# EAGLE design wearable (EAGLE 9.6.2)

## Sheet 1 of 3
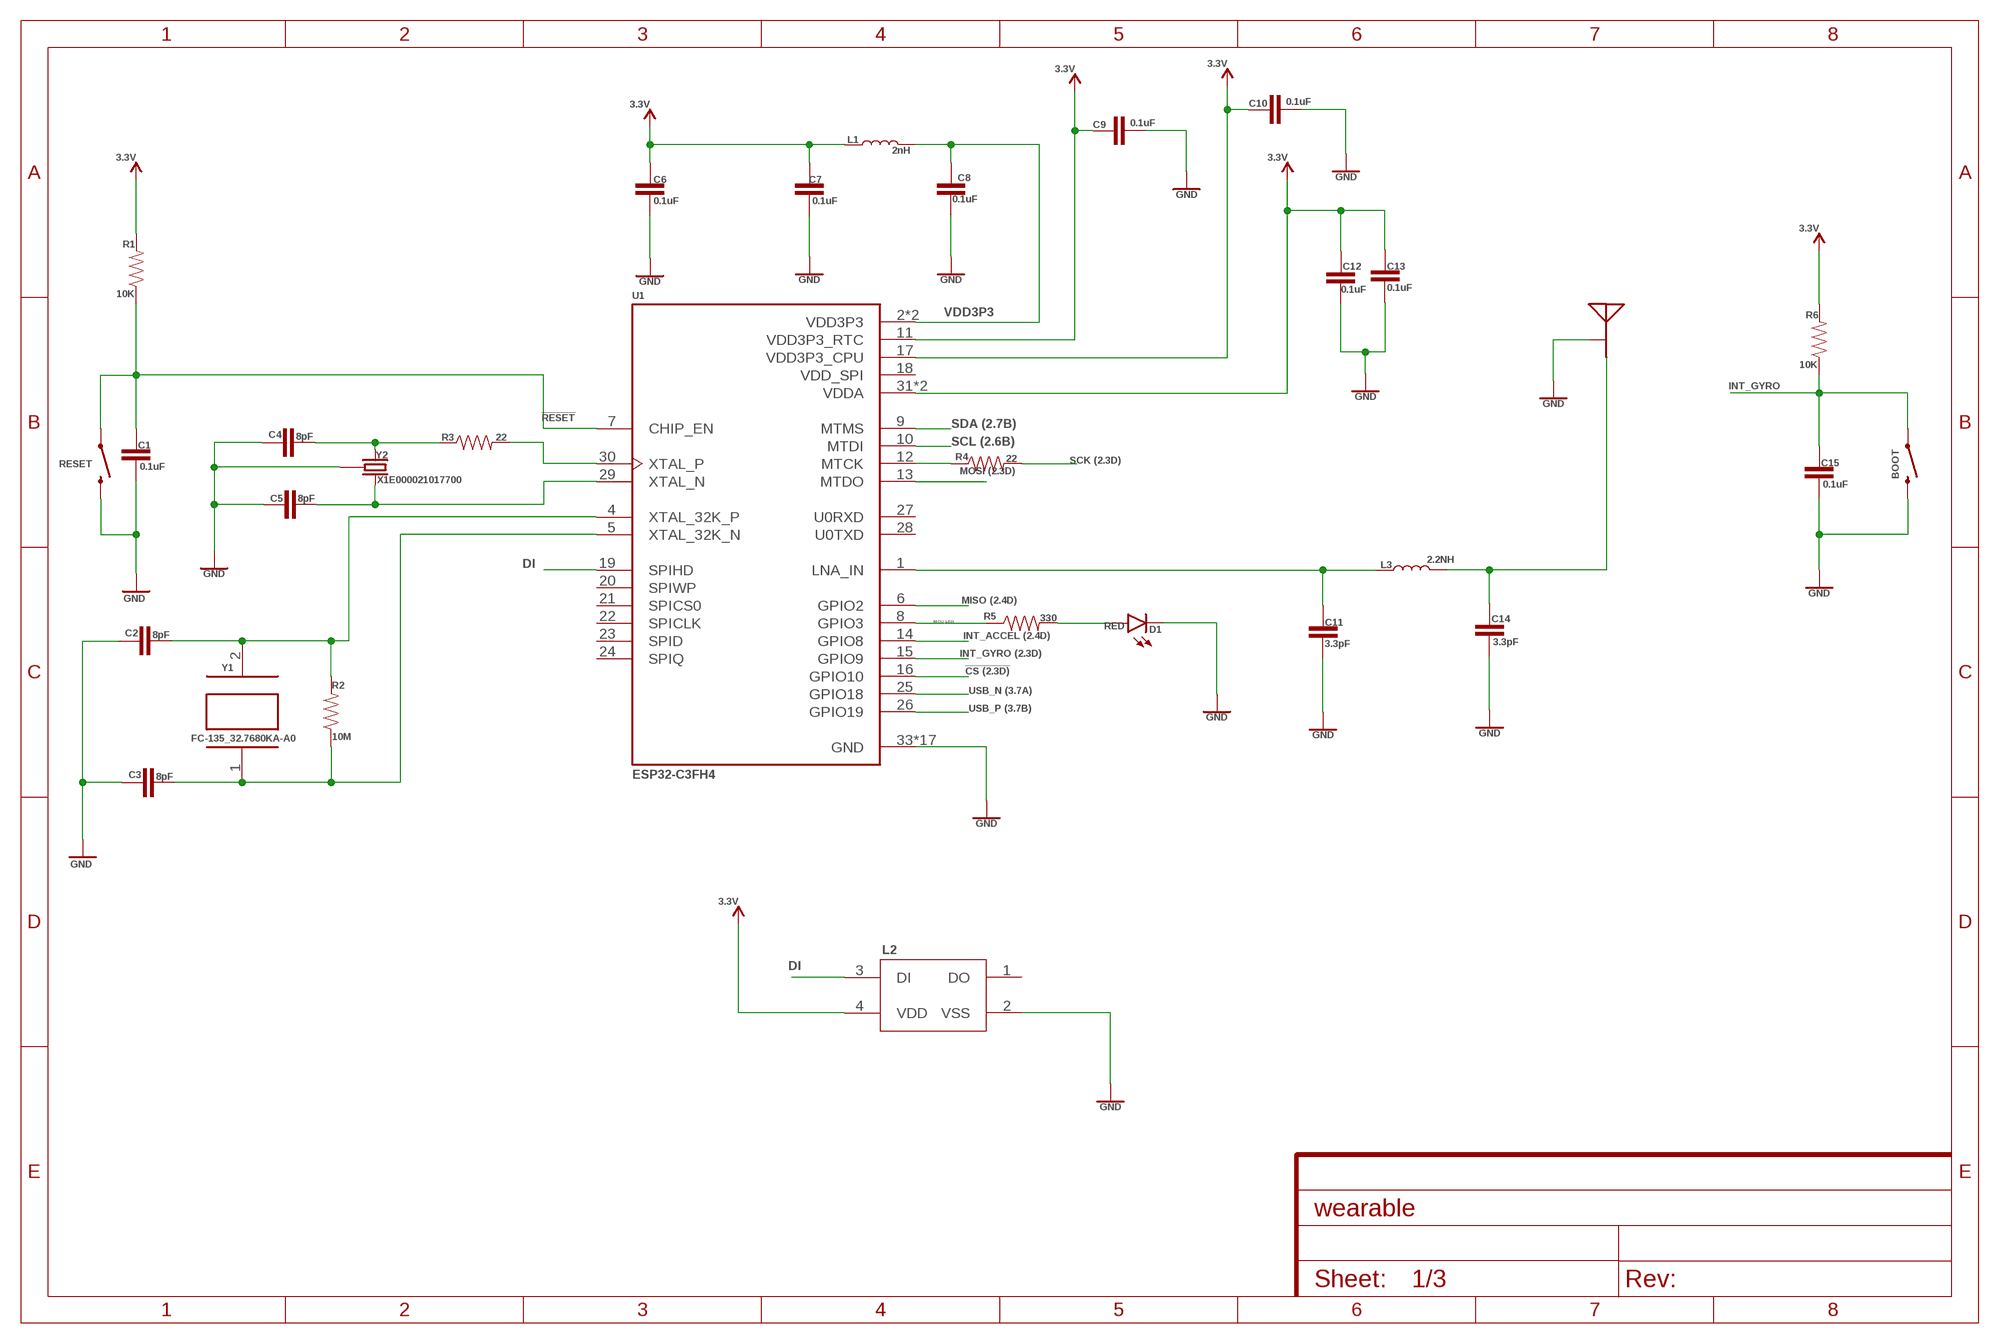
[diagram p0: schematic, sheet 1]

### Parts
ANT1  MEANDER-ANT  [MEANDER-ANT]
BOOT  MOMENTARY-SWITCH-SPST-SMD-4.6X2.8MM  [TACTILE_SWITCH_SMD_4.6X2.8MM]
C1  0.1uF  0.1UF-0402-16V-10%  [0402]
C2  8pF  6PF-0402-50V-0.5%  [0402]
C3  8pF  6PF-0402-50V-0.5%  [0402]
C4  8pF  6PF-0402-50V-0.5%  [0402]
C5  8pF  6PF-0402-50V-0.5%  [0402]
C6  0.1uF  0.1UF-0402-16V-10%  [0402]
C7  0.1uF  0.1UF-0402-16V-10%  [0402]
C8  0.1uF  0.1UF-0402-16V-10%  [0402]
C9  0.1uF  0.1UF-0402-16V-10%  [0402]
C10  0.1uF  0.1UF-0402-16V-10%  [0402]
C11  3.3pF  0.1UF-0402-16V-10%  [0402]
C12  0.1uF  0.1UF-0402-16V-10%  [0402]
C13  0.1uF  0.1UF-0402-16V-10%  [0402]
C14  3.3pF  0.1UF-0402-16V-10%  [0402]
C15  0.1uF  0.1UF-0402-16V-10%  [0402]
D1  RED  LED0603  [LED-0603]
L1  2nH  INDUCTOR-0402-3.9NH  [0402]
L2  WS2812B-2020  [WS2812B-2020]
L3  2.2NH  INDUCTOR-0402-3.9NH  [0402]
R1  10K  RESISTOR0402  [0402]
R2  10M  RESISTOR0402  [0402]
R3  22  22OHM-0402-1/10W-1%  [0402]
R4  22  22OHM-0402-1/10W-1%  [0402]
R5  330  RESISTOR0402  [0402]
R6  10K  RESISTOR0402  [0402]
RESET  MOMENTARY-SWITCH-SPST-SMD-4.6X2.8MM  [TACTILE_SWITCH_SMD_4.6X2.8MM]
U1  ESP32-C3FH4  [QFN50P500X500X90-33N]
Y1  FC-135_32.7680KA-A0  [XTAL_FC-135_32.7680KA-A0]
Y2  X1E000021017700  CRYSTAL-26MHZSMD-3.2X2.5  [CRYSTAL-SMD-3.2X2.5MM]

### Nets
3.3V: C6.1 C7.2 C9.2 C10.2 C12.1 C13.1 L1.1 L2.4(VDD) R1.2 R6.2 U1.11(VDD3P3_RTC) U1.17(VDD3P3_CPU) U1.31(VDDA) U1.32(VDDA) ; also sheet 2,3
!CS: U1.16(GPIO10) ; also sheet 2
!RESET: C1.1 R1.1 RESET.1 RESET.2 U1.7(CHIP_EN)
DI: L2.3(DI) U1.19(SPIHD)
GND: ANT1.GND BOOT.3 BOOT.4 C1.2 C2.1 C3.1 C4.1 C5.1 C6.2 C7.1 C8.1 C9.1 C10.1 C11.2 C12.2 C13.2 C14.2 C15.2 D1.C L2.2(VSS) RESET.3 RESET.4 U1.33(GND) U1.34(GND) U1.35(GND) U1.36(GND) U1.37(GND) U1.38(GND) U1.39(GND) U1.40(GND) U1.41(GND) U1.42(GND) U1.43(GND) U1.44(GND) U1.45(GND) U1.46(GND) U1.47(GND) U1.48(GND) U1.49(GND) Y2.2 Y2.4 ; also sheet 2,3
INT_ACCEL: U1.14(GPIO8) ; also sheet 2
INT_GYRO: BOOT.1 BOOT.2 C15.1 R6.1 U1.15(GPIO9) ; also sheet 2
MCU_LED: R5.1 U1.8(GPIO3)
MISO: U1.6(GPIO2) ; also sheet 2
MOSI: U1.13(MTDO) ; also sheet 2
N$3: R3.2 U1.30(XTAL_P)
N$4: C4.2 R3.1 Y2.1
N$5: C5.2 U1.29(XTAL_N) Y2.3
N$7: C11.1 L3.1 U1.1(LNA_IN)
N$8: ANT1.FEED C14.1 L3.2
N$9: D1.A R5.2
N$12: C2.2 R2.2 U1.4(XTAL_32K_P) Y1.2
N$13: C3.2 R2.1 U1.5(XTAL_32K_N) Y1.1
N$15: R4.1 U1.12(MTCK)
SCK: R4.2 ; also sheet 2
SCL: U1.10(MTDI) ; also sheet 2
SDA: U1.9(MTMS) ; also sheet 2
USB_N: U1.25(GPIO18) ; also sheet 3
USB_P: U1.26(GPIO19) ; also sheet 3
VDD3P3: C8.2 L1.2 U1.2(VDD3P3) U1.3(VDD3P3)
Unconnected: L2.1(DO) U1.20(SPIWP) U1.21(SPICS0) U1.22(SPICLK) U1.23(SPID) U1.24(SPIQ) U1.27(U0RXD) U1.28(U0TXD)

## Sheet 2 of 3
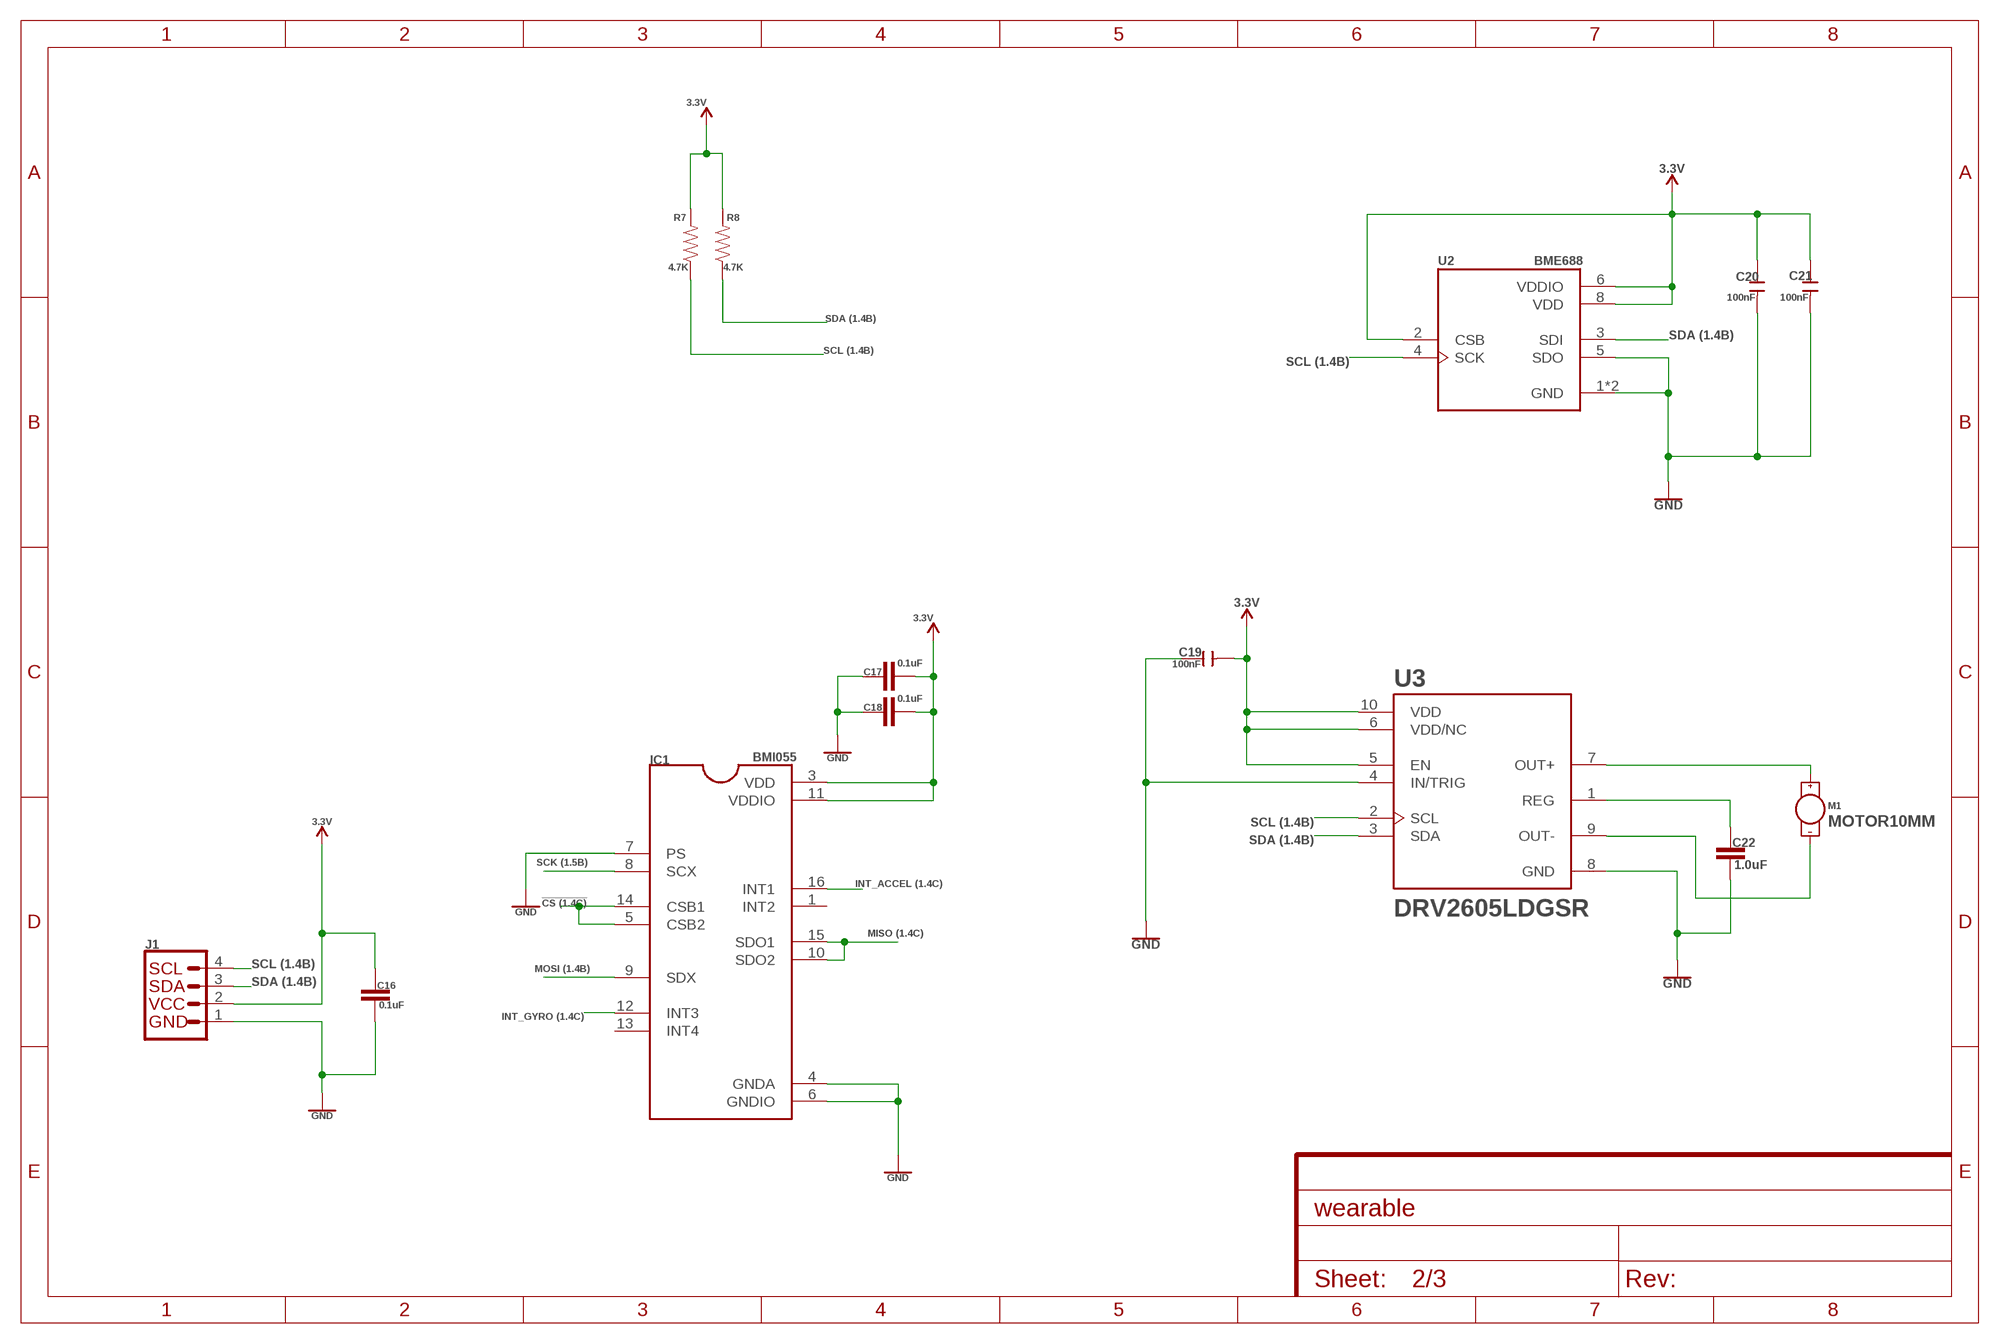
[diagram p1: schematic, sheet 2]

### Parts
C16  0.1uF  0.1UF-0402-16V-10%  [0402]
C17  0.1uF  0.1UF-0402-16V-10%  [0402]
C18  0.1uF  0.1UF-0402-16V-10%  [0402]
C19  100nF  CERAMIC-100NF-25V-10%-X7R(0402)  [C0402]
C20  100nF  CERAMIC-100NF-25V-10%-X7R(0402)  [C0402]
C21  100nF  CERAMIC-100NF-25V-10%-X7R(0402)  [C0402]
C22  1.0uF  1.0UF-0402-16V-10%  [0402]
IC1  BMI055  [QFN50P300X450X100-16N]
J1  QWIIC_CONNECTORJS-1MM  [1X04_1MM_RA]
M1  MOTOR10MM  [VIBE-MOTOR-10MM]
R7  4.7K  RESISTOR0402  [0402]
R8  4.7K  RESISTOR0402  [0402]
U2  BME688  [IC_BME688]
U3  DRV2605LDGSR  [SOP50P490X110-10N]

### Nets
3.3V: C16.1 C17.2 C18.2 C19.2 C20.1 C21.1 IC1.3(VDD) IC1.11(VDDIO) J1.2 R7.2 R8.2 U2.2(CSB) U2.6(VDDIO) U2.8(VDD) U3.5(EN) U3.6(VDD/NC) U3.10(VDD) ; also sheet 1,3
!CS: IC1.5(CSB2) IC1.14(CSB1) ; also sheet 1
GND: C16.2 C17.1 C18.1 C19.1 C20.2 C21.2 C22.2 IC1.4(GNDA) IC1.6(GNDIO) IC1.7(PS) J1.1 U2.1(GND) U2.5(SDO) U2.7(GND) U3.4(IN/TRIG) U3.8(GND) ; also sheet 1,3
INT_ACCEL: IC1.16(INT1) ; also sheet 1
INT_GYRO: IC1.12(INT3) ; also sheet 1
MISO: IC1.10(SDO2) IC1.15(SDO1) ; also sheet 1
MOSI: IC1.9(SDX) ; also sheet 1
N$6: C22.1 U3.1(REG)
N$10: M1.+ U3.7(OUT+)
N$11: M1.- U3.9(OUT-)
SCK: IC1.8(SCX) ; also sheet 1
SCL: J1.4 R7.1 U2.4(SCK) U3.2(SCL) ; also sheet 1
SDA: J1.3 R8.1 U2.3(SDI) U3.3(SDA) ; also sheet 1
Unconnected: IC1.1(INT2) IC1.13(INT4)

## Sheet 3 of 3
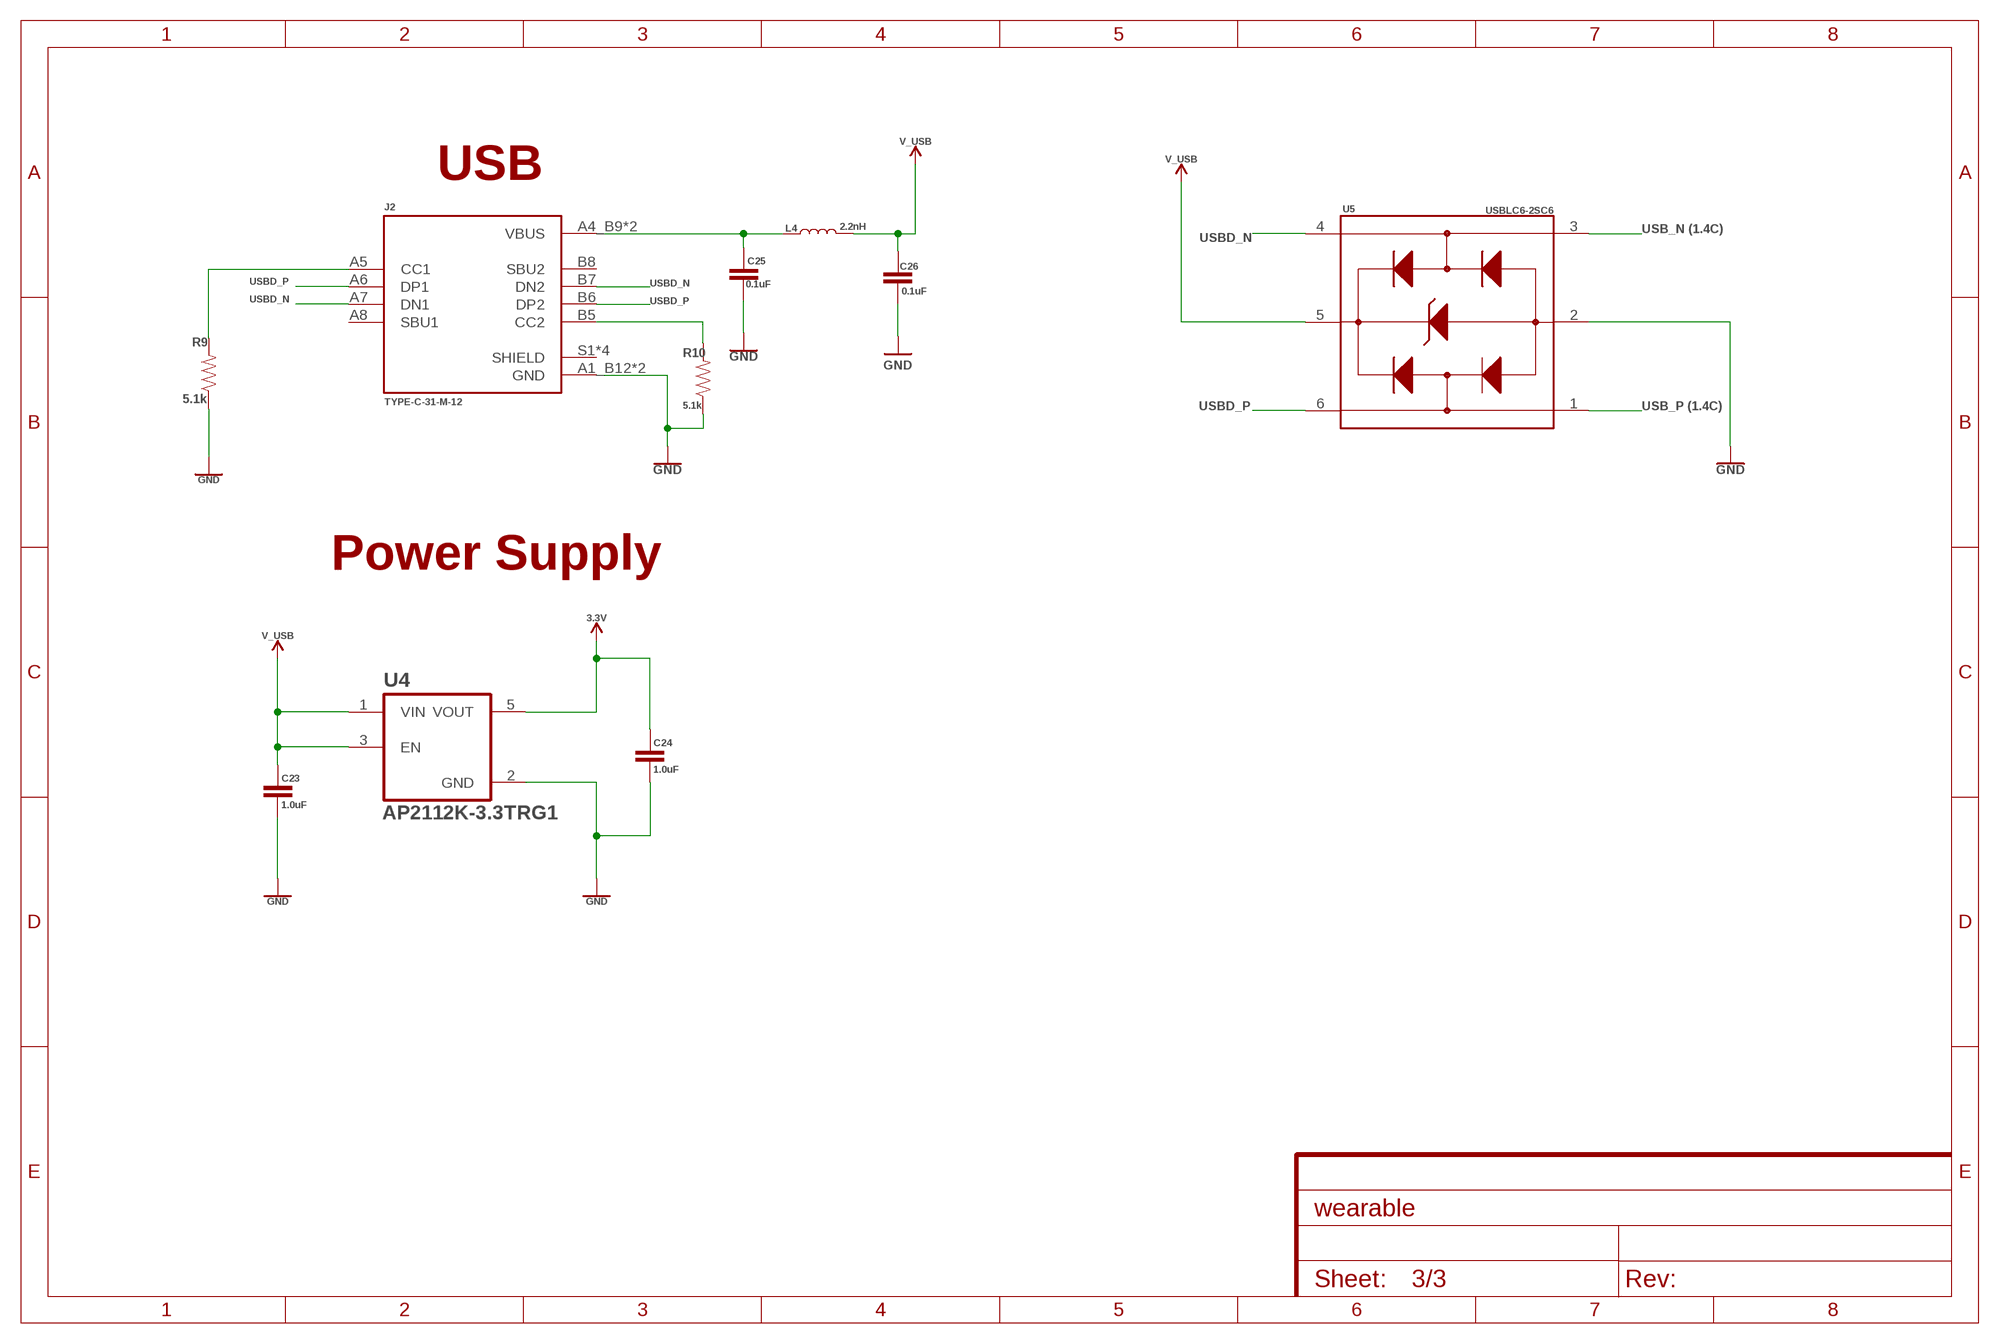
[diagram p2: schematic, sheet 3]

### Parts
C23  1.0uF  1.0UF-0402-16V-10%  [0402]
C24  1.0uF  1.0UF-0402-16V-10%  [0402]
C25  0.1uF  0.1UF-0402-16V-10%  [0402]
C26  0.1uF  0.1UF-0402-16V-10%  [0402]
J2  TYPE-C-31-M-12  [HRO_TYPE-C-31-M-12]
L4  2.2nH  INDUCTOR-0402-3.9NH  [0402]
R9  5.1k  5.6KOHM-0603-1/10W-1%  [0603]
R10  5.1k  5.6KOHM-0603-1/10W-1%  [0603]
U4  AP2112K-3.3TRG1  [SOT95P285X140-5N]
U5  USBLC6-2SC6  [SOT95P280X145-6N]

### Nets
3.3V: C24.1 U4.5(VOUT) ; also sheet 1,2
GND: C23.2 C24.2 C25.2 C26.2 J2.A1_B12(GND) J2.B1_A12(GND) R9.1 R10.1 U4.2(GND) U5.2(GND) ; also sheet 1,2
N$1: J2.A5(CC1) R9.2
N$2: J2.B5(CC2) R10.2
N$14: C25.1 J2.A4_B9(VBUS) J2.B4_A9(VBUS) L4.1
USB_N: U5.3(I/O2_IN) ; also sheet 1
USB_P: U5.1(I/O1_IN) ; also sheet 1
USBD_N: J2.A7(DN1) J2.B7(DN2) U5.4(I/O2_OUT)
USBD_P: J2.A6(DP1) J2.B6(DP2) U5.6(I/O1_OUT)
V_USB: C23.1 C26.1 L4.2 U4.1(VIN) U4.3(EN) U5.5(VBUS)
Unconnected: J2.A8(SBU1) J2.B8(SBU2) J2.S1(SHIELD) J2.S2(SHIELD) J2.S3(SHIELD) J2.S4(SHIELD)

### Notes on the sheet
- USB
- Power Supply

## Power pins joined to a net without a drawn wire
VDD_SPI: U1.18(VDD_SPI)

## Library data of the parts
ANT1 = Antennas:MEANDER-ANT
BOOT RESET = SparkFun-Switches:MOMENTARY-SWITCH-SPST: Momentary Switch (Pushbutton) - SPST Normally-open (NO) SPST momentary switches (buttons, pushbuttons). Variants PTH-12MM - 12mm square, through-hole Momentary Pushbutton Switch - 12mm Square <https://www.sparkfun.com/products/9190> (COM-09190) PTH-6.0MM, PTH-6.0MM-KIT - 6.0mm square, through-hole Mini Pushbutton Switch <https://www.sparkfun.com/products/97> (COM-00097) KIT package intended for soldering kit's - only one side of pads' copper is exposed. PTH-RIGHT-ANGLE-KIT - Right-angle, through-hole Right Angle Tactile Button <https://www.sparkfun.com/products/10791> - Used on SparkFun BigTime Watch Kit <https://www.sparkfun.com/products/11734> SMD-12MM - 12mm square, surface-mount Tactile Button - SMD (12mm) <https://www.sparkfun.com/products/12993> (COM-12993) Used on SparkFun PicoBoard <https://www.sparkfun.com/products/11888> SMD-4.5MM - 4.5mm Square Trackball Switch Used on SparkFun Blackberry Trackballer Breakout <https://www.sparkfun.com/products/13169> SMD-4.6MMX2.8MM - 4.60mm x 2.80mm, surface mount Used on SparkFun SAMD21 Mini Breakout <https://www.sparkfun.com/products/13664> SMD-5.2MM, SMD-5.2-REDUNDANT - 5.2mm square, surface-mount Mini Pushbutton Switch - SMD <https://www.sparkfun.com/products/8720> (COM-08720) Used on Arduino Pro Mini <https://www.sparkfun.com/products/11114> REDUNDANT package connects both switch circuits together SMD-6.0X3.5MM - 6.0 x 3.5mm, surface mount Momentary Reset Switch SMD <https://www.sparkfun.com/products/8229> (COM-08229) SMD-6.2MM-TALL - 6.2mm square, surface mount Tactile Button - SMD (6mm) <https://www.sparkfun.com/products/12992> Used on SparkFun Digital Sandbox <https://www.sparkfun.com/products/12651> SMD-RIGHT-ANGLE - Right-angle, surface mount Used on SparkFun Block for Intel® Edison - Arduino <https://www.sparkfun.com/products/13036>; PROD_ID: SWCH-13065
C1 C6-C10 C12 C13 C15-C18 C25 C26 = SparkFun-Capacitors:0.1UF: 0.1µF ceramic capacitors A capacitor is a passive two-terminal electrical component used to store electrical energy temporarily in an electric field.; PROD_ID: CAP-12416
C2-C5 = SparkFun-Capacitors:6PF: 6pF ceramic capacitors A capacitor is a passive two-terminal electrical component used to store electrical energy temporarily in an electric field.; PROD_ID: CAP-13455; VALUE: 6pF
C11 C14 = SparkFun-Capacitors:0.1UF: 0.1µF ceramic capacitors A capacitor is a passive two-terminal electrical component used to store electrical energy temporarily in an electric field.; PROD_ID: CAP-12416; VALUE: 0.1uF
C19-C21 = OPL_Capacitor:CERAMIC-100NF-25V-10%-X7R(0402): 302010024; MPN: CC0402KRX7R8BB104; VALUE: 100nf
C22-C24 = SparkFun-Capacitors:1.0UF: 1µF ceramic capacitors A capacitor is a passive two-terminal electrical component used to store electrical energy temporarily in an electric field.; PROD_ID: CAP-12417
D1 = SparkFun-LED:LED: LED (Generic) Standard schematic elements and footprints for 5mm, 3mm, 1206, and 0603 sized LEDs. Generic LEDs with no color specified.
IC1 = BMI055:BMI055: BMI055 6 Axis Inertial Sensor (12 Bit Acceleration Sensor + Gyroscope) 3 x 4 mm Check availability <https://pricing.snapeda.com/parts/BMI055/Bosch/view-part?ref=eda>; AVAILABILITY: In Stock; DESCRIPTION: BMI055 series Accelerometer, Gyroscope, 6 Axis Sensor Evaluation Board; MF: Bosch; MP: BMI055; PACKAGE: LGA-16 Bosch; PRICE: None; PURCHASE-URL: https://pricing.snapeda.com/search/part/BMI055/?ref=eda
J1 = SparkFun-Connectors:QWIIC_CONNECTOR: SparkFun I2C Standard Qwiic Connector An SMD 1mm pitch JST connector makes it easy and quick (get it? Qwiic?) to connect I2C devices to each other. The Qwiic system <http://www.sparkfun.com/qwiic> enables fast and solderless connection between popular platforms and various sensors and actuators. We carry 200mm <https://www.sparkfun.com/products/14204>, 100mm <https://www.sparkfun.com/products/14205>, 50mm <https://www.sparkfun.com/products/14206>, and breadboard friendly <https://www.sparkfun.com/products/14207> Qwiic cables. We also offer 10 pcs strips <https://www.sparkfun.com/products/14323> the SMD connectors.; PROD_ID: CONN-13694
J2 = TYPE-C-31-M-12:TYPE-C-31-M-12: Check availability <https://pricing.snapeda.com/parts/TYPE-C-31-M-12/HRO%20Electronics%20Co.%2C%20Ltd./view-part?ref=eda>; AVAILABILITY: Not in stock; DESCRIPTION: USB Connectors 24 Receptacle 1 8.94*7.3mm RoHS; MF: HRO Electronics Co., Ltd.; MP: TYPE-C-31-M-12; PACKAGE: Package; PRICE: None
L1 L3 L4 = SparkFun-Coils:INDUCTOR: Inductors Resist changes in electrical current. Basically a coil of wire. SparkFun Products: SparkFun Load Cell Amplifier - HX711 <https://www.sparkfun.com/products/13879> IOIO-OTG - V2.2 <https://www.sparkfun.com/products/13613>; PROD_ID: NDUC-13457; VALUE: 3.9NH
L2 = WS2812B-2020:WS2812B-2020: A small 2x2mm addressable RGB led Check availability <https://pricing.snapeda.com/parts/WS2812B-2020/WorldSemi/view-part?ref=eda>; AVAILABILITY: Not in stock; DESCRIPTION: Programmable LED; SMD; 2020; RGB; 2x2x0.84mm; 3.7÷5.3V; 2kHz; MF: WorldSemi; MP: WS2812B-2020; PACKAGE: None; PRICE: None
M1 = SparkFun-Electromechanical:MOTOR: Motor (Single-Phase) Two-terminal, single-phase motors. SparkFun Products Vibration Motor <https://www.sparkfun.com/products/8449> (ROB-08449) Physical dimension and wire connections for this powerful vibration motor. Motor has a self adhesive backing.; PROD_ID: COMP-08572; SF_SKU: ROB-08449
R1 R2 R5-R8 = SparkFun-Resistors:RESISTOR: Generic Resistor Package
R3 R4 = SparkFun-Resistors:22OHM: 22Ω resistor A resistor is a passive two-terminal electrical component that implements electrical resistance as a circuit element. Resistors act to reduce current flow, and, at the same time, act to lower voltage levels within circuits. - Wikipedia; PROD_ID: RES-12427
R9 R10 = SparkFun-Resistors:5.6KOHM: 5.6kΩ resistor A resistor is a passive two-terminal electrical component that implements electrical resistance as a circuit element. Resistors act to reduce current flow, and, at the same time, act to lower voltage levels within circuits. - Wikipedia; PROD_ID: RES-12378; VALUE: 5.6k
U1 = ESP32-C3FH4:ESP32-C3FH4: Check availability <https://pricing.snapeda.com/parts/ESP32-C3FH4/Espressif%20Systems/view-part?ref=eda>; AVAILABILITY: In Stock; DESCRIPTION: Bluetooth, WiFi 802.11b/g/n, Bluetooth v5.0 Transceiver Module 2.402GHz ~ 2.48GHz Antenna Not Included Surface Mount; MF: Espressif Systems; MP: ESP32-C3FH4; PACKAGE: VFQFN-32 Espressif Systems; PRICE: None; PURCHASE-URL: https://pricing.snapeda.com/search/part/ESP32-C3FH4/?ref=eda
U2 = BME688:BME688: Gas sensor measuring relative humidity, barometric pressure, ambient temperature and gas (VOC) Check availability <https://pricing.snapeda.com/parts/BME688/Bosch%20Sensortec/view-part?ref=eda>; AVAILABILITY: In Stock; DESCRIPTION: Gas sensor measuring relative humidity, barometric pressure, ambient temperature and gas (VOC); MF: Bosch Sensortec; MP: BME688; PACKAGE: None; PRICE: None; PURCHASE-URL: https://pricing.snapeda.com/search/part/BME688/?ref=eda
U3 = DRV2605LDGSR:DRV2605LDGSR: Haptic Driver for ERM and LRA with Built-In Library and Smart Loop Architecture 10-VSSOP -40 to 85 Check availability <https://pricing.snapeda.com/parts/DRV2605LDGSR/Texas%20Instruments/view-part?ref=eda>; AVAILABILITY: In Stock; DESCRIPTION: Haptic driver for ERM/LRA with 2-V operation, waveform library & auto-resonance tracking; MF: Texas Instruments; MP: DRV2605LDGSR; PACKAGE: VSSOP-10 Texas Instruments; PRICE: None; PURCHASE-URL: https://pricing.snapeda.com/search/part/DRV2605LDGSR/?ref=eda
U4 = AP2112K-3.3TRG1:AP2112K-3.3TRG1: AP2112 Series 0.6 A 3.3 V Fixed Output SMT LDO Linear Regulator - SOT23-5 Check availability <https://pricing.snapeda.com/parts/AP2112K-3.3TRG1/Diodes%20Inc./view-part?ref=eda>; AVAILABILITY: In Stock; DESCRIPTION: Linear Voltage Regulator IC Positive Fixed 1 Output 600mA SOT-25; MF: Diodes Inc.; MP: AP2112K-3.3TRG1; PACKAGE: SOT-753 Diodes Inc.; PRICE: None; PURCHASE-URL: https://pricing.snapeda.com/search/part/AP2112K-3.3TRG1/?ref=eda
U5 = USBLC6-2SC6:USBLC6-2SC6: Check availability <https://pricing.snapeda.com/parts/USBLC6-2SC6/STMicroelectronics/view-part?ref=eda> Check availability <https://pricing.snapeda.com/parts/USBLC6-2SC6/STMicroelectronics/view-part?ref=eda> Check availability <https://pricing.snapeda.com/parts/USBLC6-2SC6/STMicroelectronics/view-part?ref=eda>; AVAILABILITY: In Stock; DESCRIPTION: 17V Clamp 5A (8/20µs) Ipp Tvs Diode Surface Mount SOT-23-6; MF: STMicroelectronics; MP: USBLC6-2SC6; PACKAGE: SOT-23-6 STMicroelectronics; PRICE: None; PURCHASE-URL: https://pricing.snapeda.com/search/part/USBLC6-2SC6/?ref=eda
Y1 = FC-135_32.7680KA-A0:FC-135_32.7680KA-A0: None Check availability <https://pricing.snapeda.com/parts/FC-135%2032.7680KA-A0/EPSON/view-part?ref=eda>; AVAILABILITY: In Stock; DESCRIPTION: 32.768 kHz ±20ppm Crystal 12.5pF 70 kOhms 2-SMD, No Lead; MF: EPSON; MP: FC-135 32.7680KA-A0; PACKAGE: SMD-2 Epson; PRICE: None; PURCHASE-URL: https://pricing.snapeda.com/search/part/FC-135 32.7680KA-A0/?ref=eda
Y2 = SparkFun-Clocks:CRYSTAL-26MHZ: 26MHz Crystal w/ Ground Pin Digikey Example <http://www.digikey.com/product-detail/en/epson/TSX-3225%2026.0000MF09Z-AC3/SER3627CT-ND/1802878> Frequency: 26MHz Frequency Stability: ±9ppm Frequency Tolerance: ±10ppm Load Capacitance: 9pF SparkFun Products: SparkFun ESP32 Thing <https://www.sparkfun.com/products/13907> SparkFun ESP8266 Thing Dev Board <https://www.sparkfun.com/products/13711>; PROD_ID: XTAL-12454

## Board
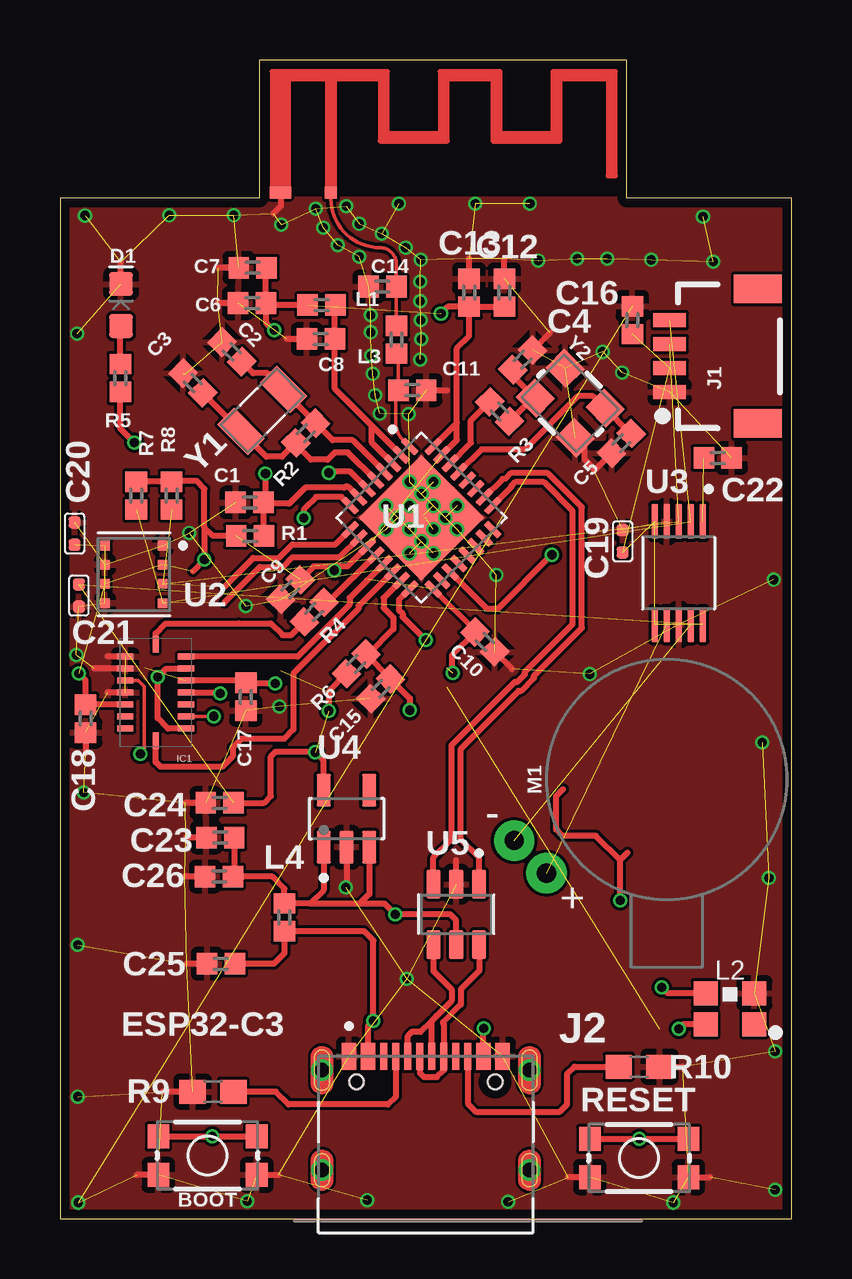
[diagram p3: board, top side]
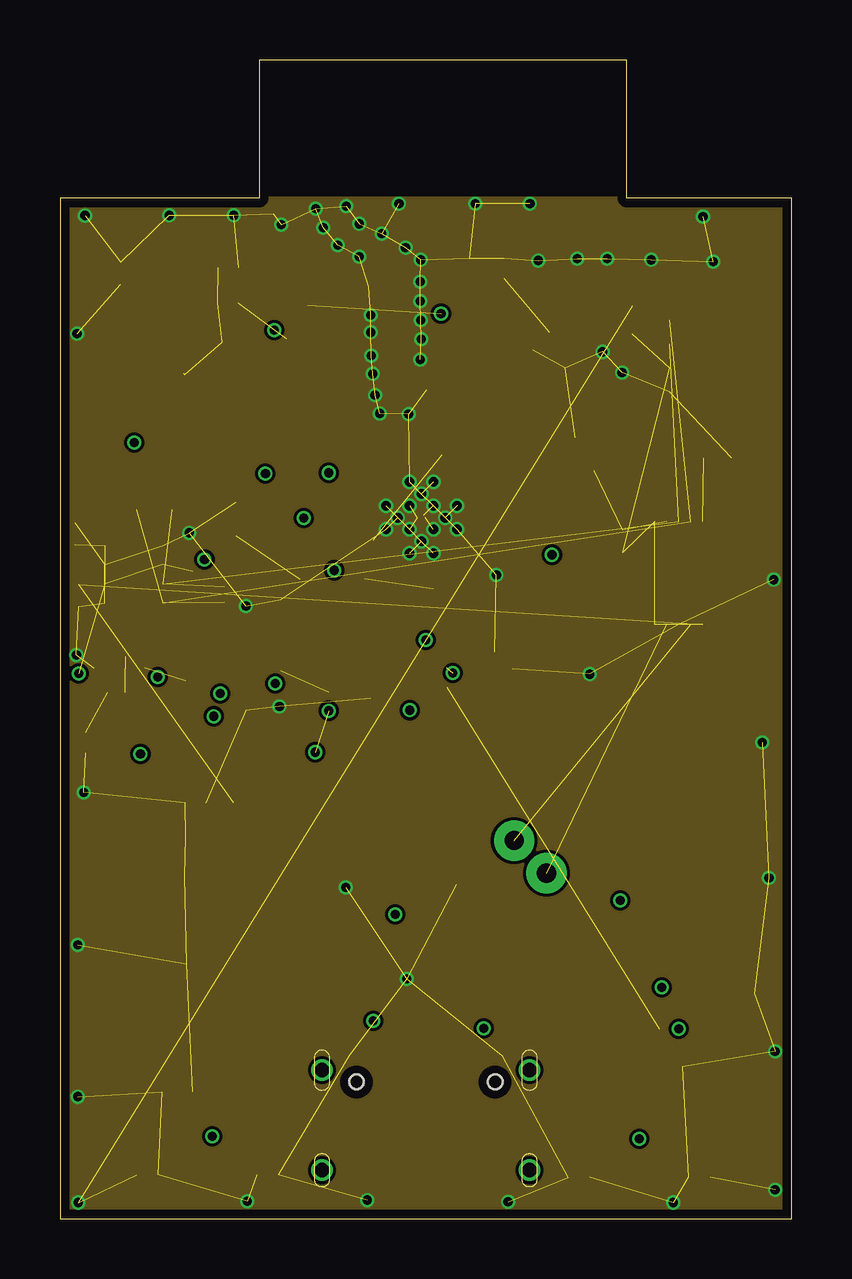
[diagram p4: board, inner layer Route2]
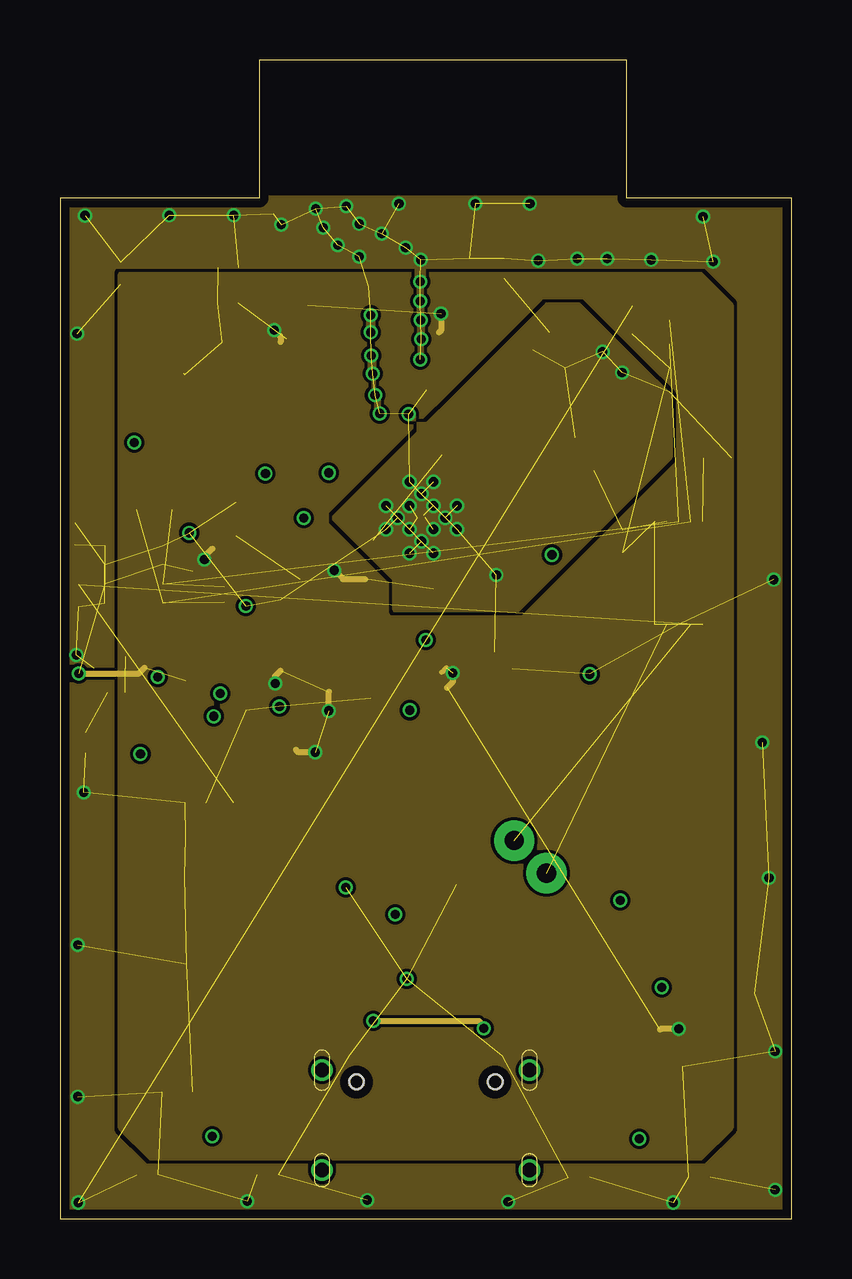
[diagram p5: board, inner layer Route15]
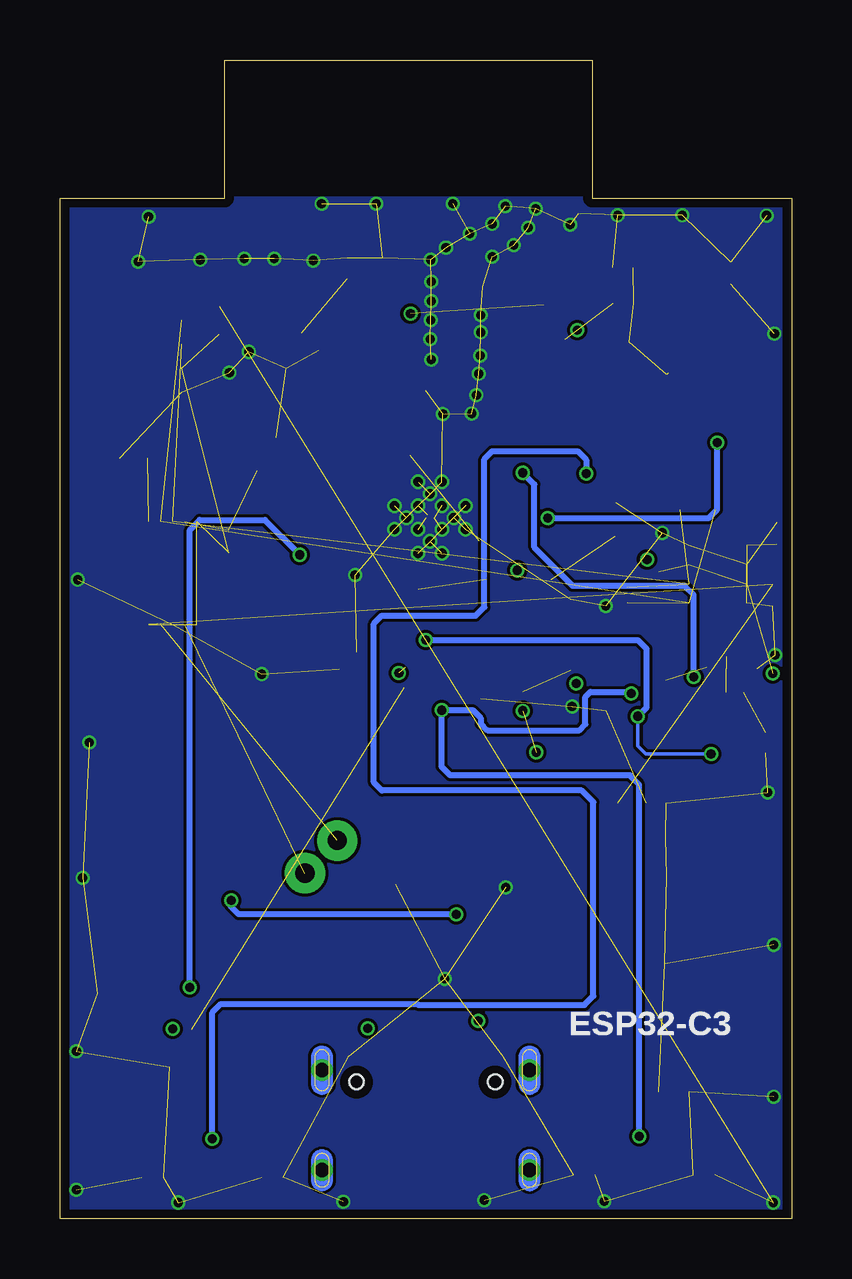
[diagram p6: board, bottom side, seen from below]

Size 30.48 x 48.31 mm. Coordinates in mm from the lower left corner, seen from the top.
Outline: 0,0 30.48,0 30.48,42.54 23.62,42.54 23.62,48.31 8.31,48.31 8.31,42.55 0,42.54 0,0
Copper layers (1*2*15*16): Top 0.035559375mm / dielectric 0.17018125mm / Route2 0.01778125mm / dielectric 47mil / Route15 0.01778125mm / dielectric 0.17018125mm / Bottom 0.035559375mm
Design rules "oshpark-4layer": minimum track width 5mil, minimum drill 10mil, track to track 5mil, track to pad 5mil, pad to pad 5mil, via to via 5mil, smd to smd 5mil, copper to edge 15mil, drill to drill 6mil, minimum pad ring 4mil, minimum via ring 4mil, stop-mask expansion 1.5mil, vias tented up to drill 0mil, thermal gap 10mil

### Footprints (pad centres in the part's own frame; a part is rotated, then mirrored left to right if it is on the bottom)
MEANDER-ANT = smd 0.5 x 0.5: FEED 2.55,-0.25 | smd 0.9 x 0.5: GND 0.45,-0.25
TACTILE_SWITCH_SMD_4.6X2.8MM = smd 0.9 x 1: 1 -2.05,-0.8; 2 2.05,-0.8; 3 2.05,0.8; 4 -2.05,0.8
0402 = smd 0.85 x 0.9: 1 -0.58,0; 2 0.58,0
C0402 = smd 0.5 x 0.5: 1 0,0.463; 2 0,-0.463
LED-0603 = smd 1 x 1: A -0.877,0; C 0.877,0
QFN50P300X450X100-16N = smd 0.675 x 0.25: 1 1.265,1.499; 2 1.265,0.999; 3 1.265,0.499; 4 1.265,-0.001; 5 1.265,-0.501; 6 1.265,-1.001; 7 1.265,-1.501; 9 -1.262,-1.5; 10 -1.262,-1; 11 -1.262,-0.5; 12 -1.262,0; 13 -1.262,0.5; 14 -1.262,1; 15 -1.262,1.5 | smd 0.25 x 0.675: 8 0,-2.012; 16 0,2.013
1X04_1MM_RA = smd 0.6 x 1.35: 1 -1.5,0; 2 -0.5,0; 3 0.5,0; 4 1.5,0 | smd 1.2 x 2: NC1 2.8,-3.675; NC2 -2.8,-3.675
HRO_TYPE-C-31-M-12 = smd 0.6 x 1.14: A1_B12 -3.2,4.75; A4_B9 -2.4,4.75; B1_A12 3.2,4.75; B4_A9 2.4,4.75 | smd 0.3 x 1.14: A5 -1.25,4.75; A6 -0.25,4.75; A7 0.25,4.75; A8 1.25,4.75; B5 1.75,4.75; B6 0.75,4.75; B7 -0.75,4.75; B8 -1.75,4.75 | drill 0.6 pad 0.9: S1 -4.325,4.17; S2 4.325,4.17; S3 -4.325,0; S4 4.325,0 | hole 0.6: -2.89,3.68; 2.89,3.68
WS2812B-2020 = smd 1 x 1: 1 1.015,-0.65; 2 1.015,0.65; 3 -1.015,0.65; 4 -1.015,-0.65
VIBE-MOTOR-10MM = drill 0.8 pad 1.676: + -5,-3.9; - -6.35,-2.54
0603 = smd 1.1 x 1: 1 -0.85,0; 2 0.85,0
QFN50P500X500X90-33N = smd 0.81 x 0.27: 1 -2.45,1.75; 2 -2.45,1.25; 3 -2.45,0.75; 4 -2.45,0.25; 5 -2.45,-0.25; 6 -2.45,-0.75; 7 -2.45,-1.25; 8 -2.45,-1.75; 17 2.45,-1.75; 18 2.45,-1.25; 19 2.45,-0.75; 20 2.45,-0.25; 21 2.45,0.25; 22 2.45,0.75; 23 2.45,1.25; 24 2.45,1.75 | smd 0.27 x 0.81: 9 -1.75,-2.45; 10 -1.25,-2.45; 11 -0.75,-2.45; 12 -0.25,-2.45; 13 0.25,-2.45; 14 0.75,-2.45; 15 1.25,-2.45; 16 1.75,-2.45; 25 1.75,2.45; 26 1.25,2.45; 27 0.75,2.45; 28 0.25,2.45; 29 -0.25,2.45; 30 -0.75,2.45; 31 -1.25,2.45; 32 -1.75,2.45 | smd 3.7 x 3.7: 33 0,0 | drill 0.4 pad 0.5: 34 -0.7,1.4; 35 0.7,1.4; 36 -1.4,0.7; 37 -0.7,0.7; 38 0,0.7; 39 0.7,0.7; 40 1.4,0.7; 41 -0.7,0; 42 0.7,0; 43 -1.4,-0.7; 44 -0.7,-0.7; 45 0,-0.7; 46 0.7,-0.7; 47 1.4,-0.7; 48 -0.7,-1.4; 49 0.7,-1.4
IC_BME688 = smd 0.4 x 0.4: 1 1.2,1.2; 2 1.2,0.4; 3 1.2,-0.4; 4 1.2,-1.2; 5 -1.2,-1.2; 6 -1.2,-0.4; 7 -1.2,0.4; 8 -1.2,1.2
SOP50P490X110-10N = smd 1.47 x 0.28: 1 -2.15,1; 2 -2.15,0.5; 3 -2.15,0; 4 -2.15,-0.5; 5 -2.15,-1; 6 2.15,-1; 7 2.15,-0.5; 8 2.15,0; 9 2.15,0.5; 10 2.15,1
SOT95P285X140-5N = smd 1.35 x 0.6: 1 -1.185,0.95; 2 -1.185,0; 3 -1.185,-0.95; 4 1.185,-0.95; 5 1.185,0.95
SOT95P280X145-6N = smd 1.21 x 0.59: 1 -1.255,0.95; 2 -1.255,0; 3 -1.255,-0.95; 4 1.255,-0.95; 5 1.255,0; 6 1.255,0.95
XTAL_FC-135_32.7680KA-A0 = smd 1 x 1.8: 1 -1.25,0; 2 1.25,0
CRYSTAL-SMD-3.2X2.5MM = smd 1.2 x 1.1: 1 -1.175,-0.875; 2 1.175,-0.875; 3 1.175,0.875; 4 -1.175,0.875

### Placement (x,y rotation side)
ANT1  8.74,43.03 0 top
BOOT  6.15,2.64 180 top
C1  7.9,29.87 180 top
C2  7.16,36.14 315 top
C3  5.54,34.85 315 top
C4  19.28,35.81 225 top
C5  23.39,32.33 45 top
C6  8,38.18 180 top
C7  8.03,39.65 0 top
C8  10.87,36.68 0 top
C9  9.6,26.24 45 top
C10  17.7,24.05 135 top
C11  14.68,34.54 0 top
C12  18.52,38.61 90 top
C13  17.04,38.61 90 top
C14  13.44,38.86 180 top
C15  13.36,22.1 225 top
C16  23.85,37.47 90 top
C17  7.75,21.77 90 top
C18  1.07,20.85 90 top
C19  23.44,28.24 0 top
C20  0.61,28.57 180 top
C21  0.79,25.98 0 top
C22  27.41,31.72 0 top
C23  6.68,15.9 180 top
C24  6.65,17.35 180 top
C25  6.71,10.64 180 top
C26  6.63,14.27 180 top
D1  2.54,38.1 90 top
IC1  3.99,21.95 180 top
J1  25.4,35.97 90 top
J2  15.24,2.03 0 top
L1  10.9,38.1 0 top
L2  27.91,8.76 0 top
L3  14.02,36.65 90 top
L4  9.35,12.57 90 top
M1  25.27,18.31 0 top
R1  7.92,28.47 180 top
R2  10.24,32.77 45 top
R3  18.31,33.66 135 top
R4  10.59,25.3 225 top
R5  2.51,35.05 90 top
R6  12.34,23.14 225 top
R7  3.17,30.15 90 top
R8  4.65,30.15 90 top
R9  6.38,5.31 0 top
R10  24.13,6.35 180 top
RESET  24.13,2.54 180 top
U1  15.06,29.24 315 top
U2  3.07,26.87 0 top
U3  25.78,26.92 270 top
U4  11.94,16.69 90 top
U5  16.51,12.7 270 top
Y1  8.43,33.71 45 top
Y2  21.26,34.01 315 top

### Tracks (layer width: path | path; a pad name or v marks a point on that pad's centre or on a via)
3.3V  (via drill 0.38)  (21 unrouted)
  Top 0.203: U1.17 17.29,24.53 C10.2
  Top 0.254: 13.04,28.28 U1.11 11.97,27.2 11.43,27.2 | U4.5 10.99,19.11 v10.64,19.46 10.62,19.48 8.99,19.48 8.79,19.28 8.79,17.63 8.51,17.35 C24.1 | U1.32 16.54,33.18 | C13.1 17.04,36.8 16.54,36.3 16.54,33.18 | C13.1 C12.1 | U1.31 16.54,32.48 16.54,33.18 | R7.2 R8.2 4.68,30.76 5.69,30.76 6.02,30.43 6.02,28.83 | L1.1 8.66,38.1 C6.1 | C6.1 8.58,39.62 C7.2 | C6.1 8.58,37.37 8.91,37.03 v8.93,37.05 | C9.2 10.57,27.2 11.43,27.2 | 11.43,27.2 v11.43,27.04 | R1.2 6.38,28.47 6.02,28.83 | 5.53,27 v6.02,27.48 6.02,28.83 | IC1.3 1.08,21.45 C18.2 1.07,22.45 v0.79,22.73 | IC1.11 7.65,22.45 C17.2 8.95,22.35 v8.97,22.33 | R6.2 11.2,22 v11.2,21.18 | L2.4 25.97,8.11 v25.78,7.92 | C13.1 16.16,38.03 v15.88,37.74 | C10.2 16.33,23.5 16.33,22.78 v16.36,22.76
  Route15 0.203: 16.1,22.99 15.9,22.78
  Route15 0.254: v10.64,19.46 9.93,19.46 9.83,19.56 | v8.93,37.05 9.2,36.78 9.2,36.55 | v11.43,27.04 11.8,26.67 12.7,26.67 | v6.02,27.48 6.02,27.61 6.35,27.94 | v0.79,22.73 3.28,22.73 3.53,22.99 | v11.2,21.18 11.2,21.97 | v8.97,22.33 8.97,22.63 9.2,22.86 | v25.78,7.92 25.02,7.92 24.99,7.9 | v15.88,37.74 15.88,37.03 15.8,36.96 | v16.36,22.76 16.36,22.38 16.13,22.15
  pour Route15 (rank 2): 2.54,39.37 26.67,39.37 27.94,38.1 27.94,3.81 26.67,2.54 3.81,2.54 2.54,3.81
!CS  (via drill 0.38)
  Top 0.152: v6.4,20.95 IC1.14 | IC1.5 3.26,22.45 3.5,22.2 3.5,19.53 v3.35,19.38
  Top 0.254: U1.16 14.12,25.82 14.12,25.38 14.27,25.23 14.27,25.09 v15.24,24.13
  Bottom 0.152: v6.4,20.95 6.4,19.71 6.07,19.38 v3.35,19.38
  Bottom 0.254: v15.24,24.13 6.4,24.13 6.04,23.77 6.04,21.31 v6.4,20.95
!RESET  (via drill 0.38)
  Top 0.254: RESET.2 v24.13,3.34 RESET.1 | R1.1 8.48,28.5 8.48,29.82 | 8.48,29.82 C1.1 8.56,29.95 v8.56,31.06 | U1.7 12,30.53 11.89,30.53 11.84,30.48 10.21,30.48 9.55,29.82 8.48,29.82
  Bottom 0.254: v24.13,3.34 24.13,8.61 23.77,8.97 15.6,8.97 15.55,8.91 8.64,8.91 8.25,9.3 8.25,17.37 8.74,17.86 17.07,17.86 17.4,18.19 17.4,24.82 17.07,25.15 13.16,25.15 12.8,25.5 12.8,31.67 12.47,32 8.91,32 8.56,31.65 v8.56,31.06
DI  (via drill 0.38)
  Top 0.254: L2.3 25.31,9.41 v25.07,9.65 | v20.5,27.69 18.24,25.43 17.81,25.43 U1.19
  Bottom 0.254: v25.07,9.65 25.07,28.73 24.66,29.13 21.95,29.13 v20.5,27.69
GND  (via drill 0.38)  (123 unrouted)
  Top 0.254: R10.1 25.93,6.35 | R9.1 4.27,5.31 | C13.2 17.04,40.04 | C23.2 5.25,15.9 | C24.2 5.22,17.35 | C12.2 18.52,40.04 | C4.1 20.41,36.95 | C5.1 22.33,31.27 | 22.33,31.27 22.26,31.2 | IC1.4 1.98,21.95 | IC1.6 1.42,22.95 | IC1.7 1.98,23.45 | C6.2 6.57,38.18 | C7.1 6.59,39.65 | C8.1 9.44,36.68 | C10.1 18.84,22.92 | C10.1 | RESET.3 21.18,1.74 | RESET.4 27.08,1.74 | 5.19,35.19 5.19,35.17 | BOOT.3 3.19,1.84 | BOOT.4 9.1,1.84 | C18.1 1.07,19.42 | C25.2 5.27,10.64 | C26.2 5.2,14.28 | C11.2 16.11,34.54 | D1.C 2.54,39.88 | U5.2 16.51,14.96 | U1.33 15.04,29.21 14.88,29.21 | U1.33 15.16,29.34 | U1.33 15.21,29.23 | v11.91,13.82 11.94,13.84 U4.2 | ANT1.GND 9.19,42.21 8.89,41.91 | Y2.2 21.84,32.19 21.84,31.67 22.25,31.27 22.33,31.27
  other vias: 4.55,41.83 22.61,36.14 5.38,28.6 7.75,25.55 9.14,21.36 14.45,10.01 22.07,22.71 0.69,23.52 1.04,41.83 7.24,41.83 23.42,35.28 18.19,26.85 14.12,42.32 17.3,42.32 19.58,42.32 26.79,41.78 29.74,26.64 29.26,19.86 29.54,14.22 29.79,6.99 29.79,1.22 25.55,0.69 18.67,0.71 12.8,0.79 7.8,0.74 0.76,0.69 0.74,5.1 0.74,11.43 0.99,17.78 0.71,36.9 9.22,41.45 10.66,42.11 10.97,41.33 11.58,40.59 12.47,40.11 11.93,42.22 12.47,41.48 13.41,41.07 14.4,40.49 15.03,39.98 19.93,39.95 21.56,40.03 22.8,40.03 24.63,39.98 27.22,39.9 15.01,39.07 15.01,38.25 15.03,37.47 15.06,36.68 15.01,35.81 14.52,33.55 13.33,33.58 13.13,34.34 13.03,35.23 12.97,35.99 12.95,36.96 12.95,37.67
  pour Top: -3.81,0 -3.81,40.06 -1.32,42.55 32.26,42.55 32.49,42.32 32.49,-0.53 30.63,-2.39 -2.97,-2.39 -3.71,-1.65 -3.71,-0.1
  pour Route2: -3.86,0 -3.86,40.06 -1.37,42.55 32.21,42.55 36.25,38.51 36.25,-2.39 -3.02,-2.39 -3.76,-1.65 -3.76,-0.1
  pour Bottom: -5.13,0 -5.13,40.06 -2.64,42.55 30.94,42.55 34.98,38.51 34.98,-8.74 -5.03,-8.74 -5.03,-0.1
  pour Route15 (rank 6): 0,42.55 30.35,42.55 30.68,42.21 30.68,0.18 30.45,-0.05 0.13,-0.05 -0.1,0.18 -0.1,42.49 -0.03,42.57 -0.03,43.15 0,43.18
  pour Route15: 13.97,25.4 13.97,26.67 11.43,29.21 20.32,38.1 21.59,38.1 24.13,35.56 25.4,34.29 25.4,33.02 25.4,31.75 20.32,26.67 19.05,25.4
INT_ACCEL
  Top 0.254: U1.14 12.45,25.56 12.45,25.45 9.73,22.73 9.73,20.4 9.35,20.02 7.54,20.02 7.19,19.66 7.19,19.28 6.76,18.85 4.19,18.85 3.99,19.05 IC1.16
INT_GYRO  (via drill 0.38)
  Top 0.254: BOOT.2 v6.35,3.44 BOOT.1 | U1.15 13.49,25.89 13.49,25.48 13.89,25.07 13.89,24.59 12.86,23.55 R6.1 12.75,23.52 C15.1 14.58,21.7 v14.58,21.21 | v6.68,21.9 6.63,21.95 IC1.12
  Bottom 0.254: v6.35,3.44 6.35,18.11 6.73,18.49 14.22,18.49 14.58,18.85 v14.58,21.21 13.28,21.21 12.95,20.88 12.95,20.65 12.68,20.37 8.84,20.37 8.59,20.62 8.59,21.77 8.38,21.97 6.75,21.97 v6.68,21.9
MCU_LED  (via drill 0.38)
  Top 0.254: U1.8 11.72,30.1 10.67,30.1 10.16,29.59 v10.16,29.21 | v3.1,32.36 2.52,32.94 R5.1
  Bottom 0.254: v10.16,29.21 3.45,29.21 3.1,29.57 v3.1,32.36
MISO  (via drill 0.38)
  Top 0.254: IC1.15 4.5,20.45 4.06,20.88 4.06,22.58 v4.08,22.59 4.43,22.95 IC1.10 | v11.2,31.1 11.27,31.17 12.07,31.17 U1.6
  Bottom 0.254: v4.08,22.59 4.08,26.02 4.45,26.39 9.12,26.39 10.72,27.99 10.72,30.62 v11.2,31.1
MOSI
  Top 0.254: U1.13 12.07,25.89 12.07,25.6 9.91,23.44 IC1.9
N$1
  Top 0.254: J2.A5 13.99,5.1 13.66,4.78 9.53,4.78 8.99,5.31 R9.2
N$2
  Top 0.254: J2.B5 16.99,4.8 17.32,4.47 20.83,4.47 21.13,4.78 21.13,6.04 21.44,6.35 R10.2
N$3
  Top 0.254: U1.30 17.12,32.35 17.12,33.28 R3.2
N$4
  Top 0.254: R3.1 19.7,34.22 Y2.1 18.87,35.16 C4.2
N$5
  Top 0.254: C5.2 23.76,32.74 Y2.3 22.22,34.29 21.56,34.29 19.36,32.08 17.55,32.08 U1.29
N$6  (1 unrouted)
N$7
  Top 0.152: L3.1 arc-90 14.1,35.99 C11.1 arc45 14,34.29 14,33.15 arc45 14.26,32.52 U1.1
N$8
  Top 0.152: ANT1.FEED 11.29,42.53 arc90 13.34,40.49 arc-90 14.02,39.81 C14.1 arc-90 C14.1 L3.2
N$9
  Top 0.254: R5.2 2.52,37.2 D1.A
N$10  (1 unrouted)
N$11  (1 unrouted)
N$12
  Top 0.254: U1.4 12.19,32.46 11.36,32.46 R2.2 9.32,34.51 Y1.2 8.65,35.26 8.05,35.26 C2.2
N$13
  Top 0.254: C3.2 5.95,34.42 Y1.1 8.59,31.77 9.25,31.77 R2.1 9.83,32.29 10.46,31.65 11.15,31.65 11.45,31.95 11.99,31.95 U1.5
N$14  (via drill 0.38)
  Top 0.254: C25.1 8.91,10.64 9.35,11.07 L4.1 12.67,11.99 13.06,11.61 v13.06,8.26 12.84,8.04 J2.A4_B9 | J2.B4_A9 17.64,7.94 v17.65,7.95
  Route15 0.254: v13.06,8.26 17.45,8.26 17.65,8.05 v17.65,7.95
N$15
  Top 0.254: U1.12 11.18,25.71 R4.1
SCK
  Top 0.254: IC1.8 3.99,24.41 4.39,24.82 7.45,24.82 7.46,24.83 8.78,24.83 9.27,24.33 9.63,24.33 R4.2
SCL  (4 unrouted)
  Top 0.254: U1.10 12.45,28.37 11.66,27.58 9.68,27.58 9.28,27.18 8.33,27.18 6.85,25.7
SDA  (4 unrouted)
  Top 0.254: U1.9 11.47,28.12 9.68,28.12 9.12,27.56 8.05,27.56 6.84,26.34
USB_N
  Top 0.254: U5.3 15.56,15.07 16.32,15.83 16.32,19.75 18.96,22.39 19.06,22.39 19.37,22.7 19.37,22.8 21.36,24.8 21.36,29.52 20.17,30.71 18.95,30.71 18.82,30.58 18.82,30.52 U1.25
USB_P
  Top 0.254: U5.1 17.46,15.07 16.7,15.83 16.7,19.6 19.11,22.01 19.21,22.01 19.75,22.54 19.75,22.64 21.74,24.64 21.74,29.67 20.32,31.09 18.79,31.09 18.55,30.85 18.45,30.85 U1.26
USBD_N
  Top 0.254: 15.49,11.38 U5.4 15.56,10.33 16.32,9.57 16.32,9.1 15.68,8.45 15.49,8.27 | J2.A7 15.49,8.27 | J2.B7 14.49,7.63 14.66,7.8 15.02,7.8 15.49,8.27
USBD_P
  Top 0.254: U5.6 17.46,10.33 16.7,9.57 16.7,8.94 15.96,8.2 15.96,8.14 15.99,8.11 J2.B6 15.99,6.2 15.7,5.92 15.16,5.92 14.99,6.09 J2.A6
V_USB  (via drill 0.38)
  Top 0.254: 7.62,14.28 8.84,14.28 9.35,13.77 L4.2 10.43,13.15 | 7.62,14.28 C26.1 | U4.1 10.99,13.71 10.43,13.15 | U4.3 12.89,13.55 12.49,13.15 | 10.43,13.15 12.49,13.15 | C23.1 7.26,14.63 7.62,14.28 | 12.49,13.15 13.52,13.15 v13.97,12.7 16.26,12.7 16.51,12.45 U5.5 | v23.34,13.28 23.34,14.96 | 23.34,14.96 23.65,15.27 | 23.34,14.96 22.33,15.98 20.93,15.98 20.68,16.23 20.68,17.63 20.95,17.91
  Bottom 0.254: v13.97,12.7 23.04,12.7 23.37,13.03 23.37,13.26 v23.34,13.28
VDD3P3
  Top 0.254: U1.2 13,33.07 | 13,33.07 11.45,34.61 C8.2 11.45,38.08 L1.2 | U1.3 13,32.36 13,33.07

### Text on the board
tPlace: ESP32-C3
bPlace: ESP32-C3